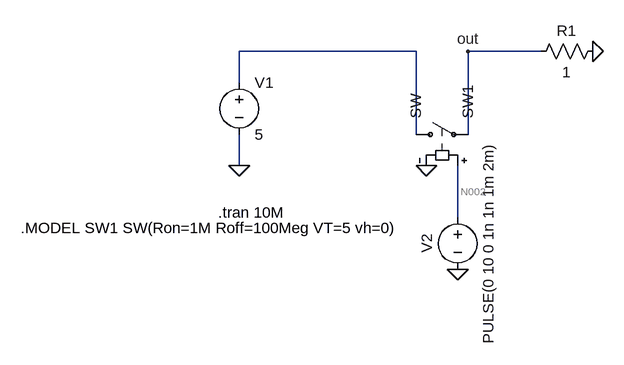
[diagram p0: schematic Draft25.asc]
Draft25.asc, the LTspice schematic file:
Version 4
SHEET 1 880 680
WIRE 224 48 -48 48
WIRE 416 48 304 48
WIRE -48 96 -48 48
WIRE 224 176 224 48
WIRE 304 176 304 48
WIRE -48 224 -48 176
WIRE 288 304 288 224
FLAG -48 224 0
FLAG 288 384 0
FLAG 240 224 0
FLAG 496 48 0
FLAG 304 48 out
SYMBOL voltage -48 80 R0
WINDOW 123 0 0 Left 0
WINDOW 39 0 0 Left 0
SYMATTR InstName V1
SYMATTR Value 5
SYMBOL sw 208 176 R270
SYMATTR InstName SW
SYMATTR Value SW1
SYMBOL voltage 288 288 R0
WINDOW 0 -32 56 VBottom 2
WINDOW 3 32 56 VTop 2
WINDOW 123 0 0 Left 0
WINDOW 39 0 0 Left 0
SYMATTR InstName V2
SYMATTR Value PULSE(0 10 0 1n 1n 1m 2m)
SYMBOL res 512 32 R90
WINDOW 0 0 56 VBottom 2
WINDOW 3 32 56 VTop 2
SYMATTR InstName R1
SYMATTR Value 1
TEXT -384 320 Left 2 !.MODEL SW1 SW(Ron=1M Roff=100Meg VT=5 vh=0)
TEXT -80 296 Left 2 !.tran 10M

The netlist it stands for:
* Draft25.asc
V1 N001 0 5
SW N001 out N002 0 SW1
V2 N002 0 PULSE(0 10 0 1n 1n 1m 2m)
R1 0 out 1
.MODEL SW1 SW(Ron=1M Roff=100Meg VT=5 vh=0)
.tran 10M
.backanno
.end

* Results of the author's LTspice run, read from the files saved beside the schematic
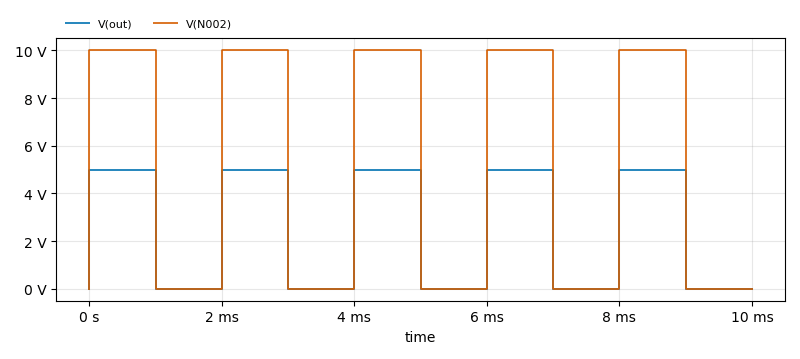
[diagram p1: Transient Analysis of Draft25.asc, plotted from the saved traces]
* Transient Analysis, 1 run:
*   V(out): min 0 V, max 4.995 V, average 2.498 V, rms 3.532 V, last 0 V
*   V(N002): min 0 V, max 10 V, average 5 V, rms 7.071 V, last 0 V